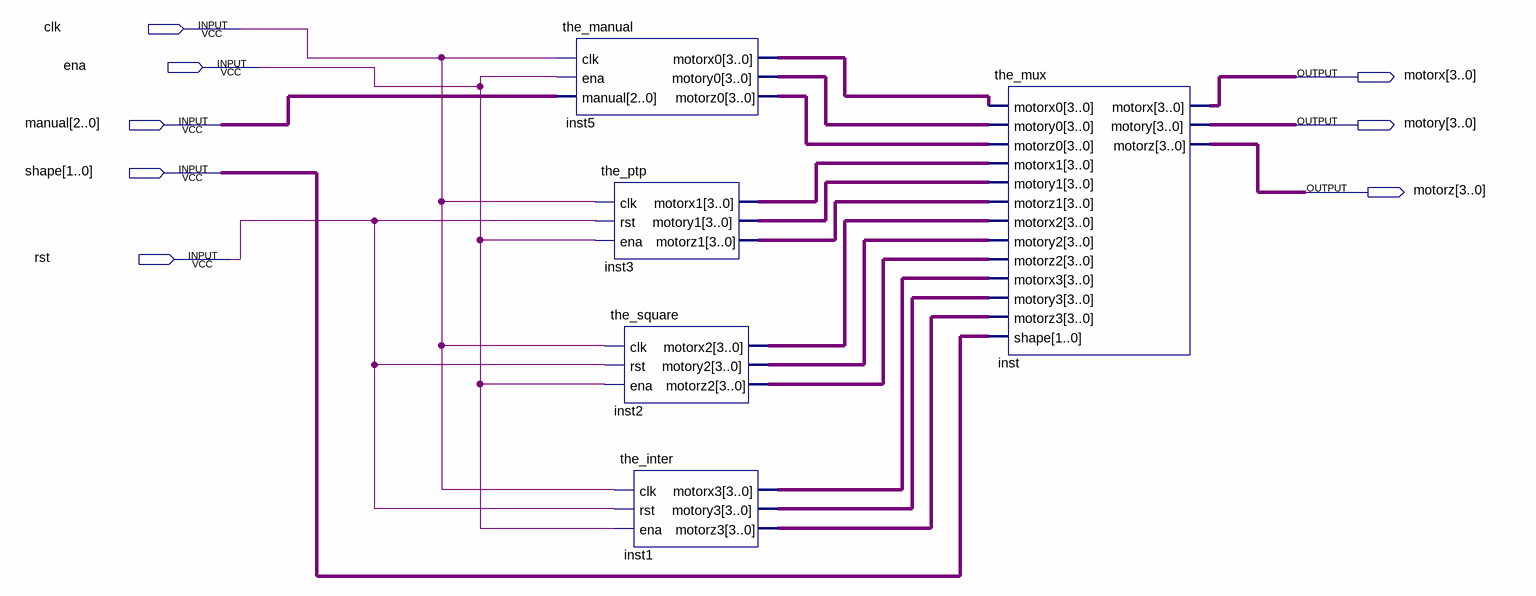
[diagram p0: schematic sheet]
// Quartus schematic the_bdf.bdf as structural Verilog: 5 symbols, 8 pins
module the_bdf (
  input  clk,
  input  ena,
  input  [2:0] manual,
  input  [1:0] shape,
  input  rst,
  output [3:0] motorx,
  output [3:0] motory,
  output [3:0] motorz
);

  wire [3:0] inst1_motorx3, inst1_motory3, inst1_motorz3, inst2_motorx2, inst2_motory2, inst2_motorz2,
       inst3_motorx1, inst3_motory1, inst3_motorz1, inst5_motorx0, inst5_motory0, inst5_motorz0;

  the_manual inst5 (
    .clk(clk), .ena(ena), .manual(manual), .motorx0(inst5_motorx0), .motory0(inst5_motory0),
    .motorz0(inst5_motorz0));
  the_ptp inst3 (
    .clk(clk), .rst(rst), .ena(ena), .motorx1(inst3_motorx1), .motory1(inst3_motory1), .motorz1(inst3_motorz1));
  the_square inst2 (
    .clk(clk), .rst(rst), .ena(ena), .motorx2(inst2_motorx2), .motory2(inst2_motory2), .motorz2(inst2_motorz2));
  the_inter inst1 (
    .clk(clk), .rst(rst), .ena(ena), .motorx3(inst1_motorx3), .motory3(inst1_motory3), .motorz3(inst1_motorz3));
  the_mux inst (
    .motorx0(inst5_motorx0), .motory0(inst5_motory0), .motorz0(inst5_motorz0), .motorx1(inst3_motorx1),
    .motory1(inst3_motory1), .motorz1(inst3_motorz1), .motorx2(inst2_motorx2), .motory2(inst2_motory2),
    .motorz2(inst2_motorz2), .motorx3(inst1_motorx3), .motory3(inst1_motory3), .motorz3(inst1_motorz3),
    .shape(shape), .motorx(motorx), .motory(motory), .motorz(motorz));
endmodule
